# EAGLE design power_supply (EAGLE 7.1.0)
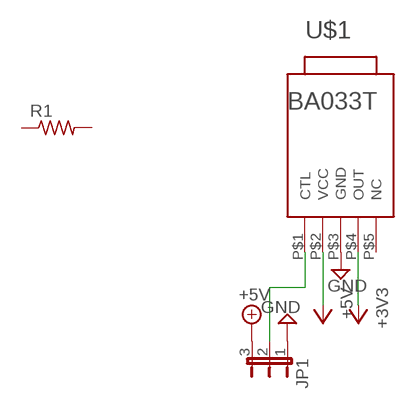
[diagram p0: schematic, sheet 1]

## Parts
JP1  JP2E  [JP2]
R1  R-US_R0603  [R0603]
U$1  BA033T  [TO220FP-5]

## Nets
+3V3: U$1.P$4(OUT)
+5V: JP1.3 U$1.P$2(VCC)
GND: JP1.1 U$1.P$3(GND)
N$1: JP1.2 U$1.P$1(CTL)
Unconnected: R1.1 R1.2 U$1.P$5(NC)

## Library data of the parts
JP1 = jumper:JP2E: JUMPER
R1 = resistor:R-US_: RESISTOR, American symbol
U$1 = rohm:BA033T

## Board
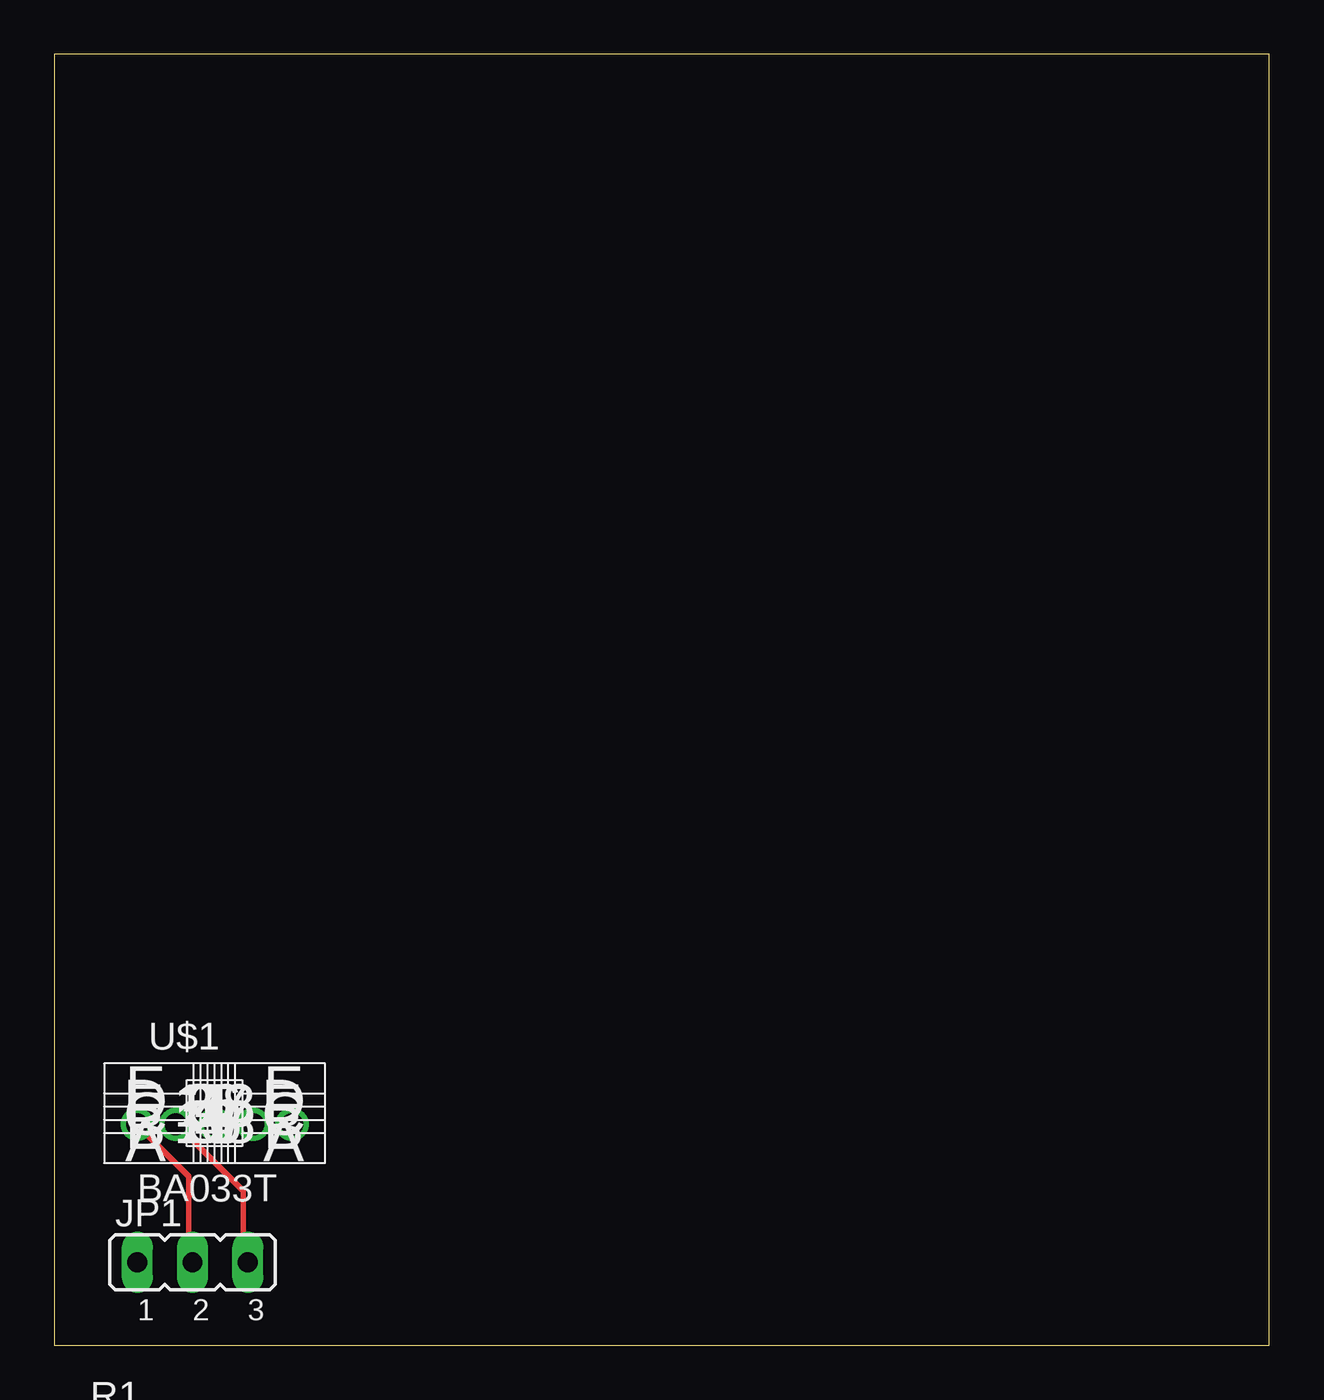
[diagram p1: board, top side]
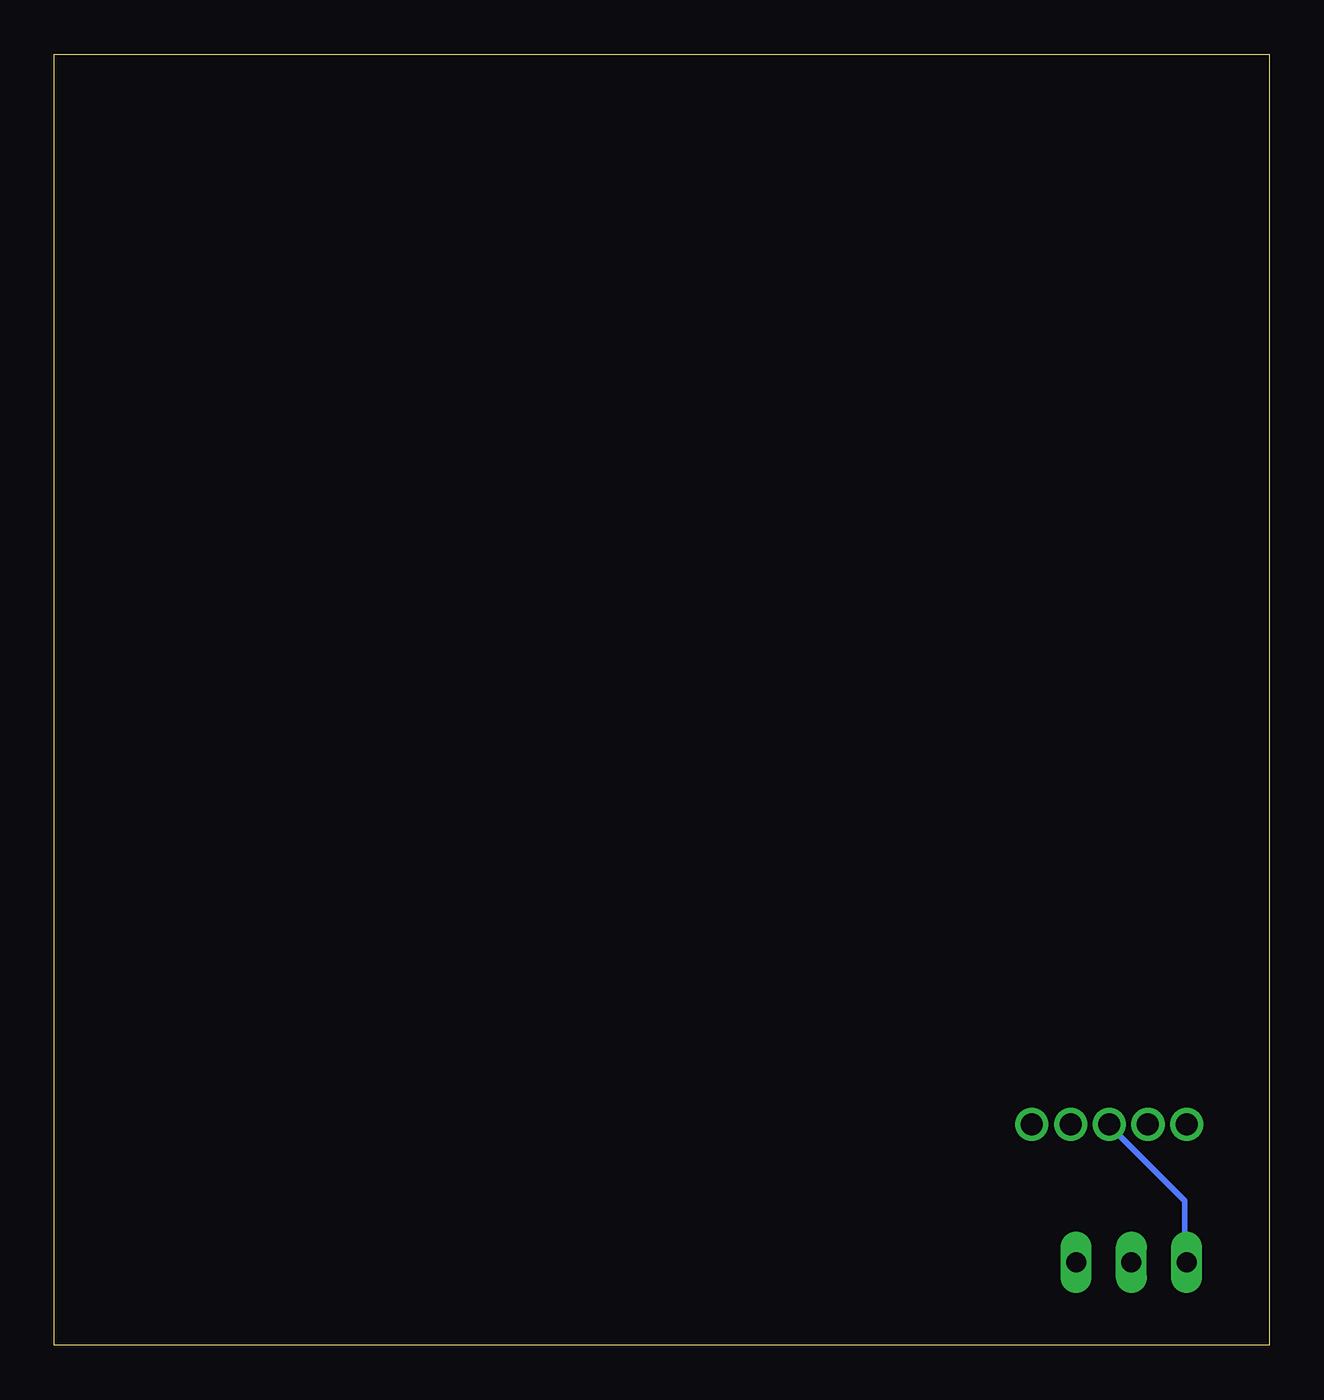
[diagram p2: board, bottom side, seen from below]

Size 55.86 x 59.36 mm. Coordinates in mm from the lower left corner, seen from the top.
Outline: 0,0 55.86,0 55.86,59.36 0,59.36 0,0
Copper layers (1*16): Top 0.035mm / dielectric 1.5mm / Bottom 0.035mm
Design rules "default": minimum track width 10mil, minimum drill 24mil, track to track 8mil, track to pad 8mil, pad to pad 8mil, via to via 8mil, smd to smd 8mil, copper to edge 40mil, drill to drill 8mil, minimum pad ring 10mil, minimum via ring 8mil, stop-mask expansion 4mil, vias tented up to drill 0mil, thermal gap 10mil

### Footprints (pad centres in the part's own frame; a part is rotated, then mirrored left to right if it is on the bottom)
JP2 = drill 0.914 long: 1 -2.54,0; 2 0,0; 3 2.54,0
R0603 = smd 1 x 1.1: 1 -0.85,0; 2 0.85,0
TO220FP-5 = drill 1.016: P$1 0,0; P$2 1.778,0; P$3 3.556,0; P$4 5.334,0; P$5 7.112,0

### Placement (x,y rotation side)
JP1  6.35,3.81 0 top
R1  2.54,-3.81 0 top  (outside the outline)
U$1  3.81,10.16 0 top

### Tracks (layer width: path | path; a pad name or v marks a point on that pad's centre or on a via)
+5V
  Top 0.254: JP1.3 8.69,3.89 8.69,7.09 5.71,10.06 U$1.P$2
GND
  Bottom 0.254: JP1.1 3.89,3.89 3.89,6.63 7.32,10.06 U$1.P$3
N$1
  Top 0.254: JP1.2 6.17,3.89 6.17,7.77 3.89,10.06 U$1.P$1